# Altium project Smarthome_Wall_Switch.PrjPcb
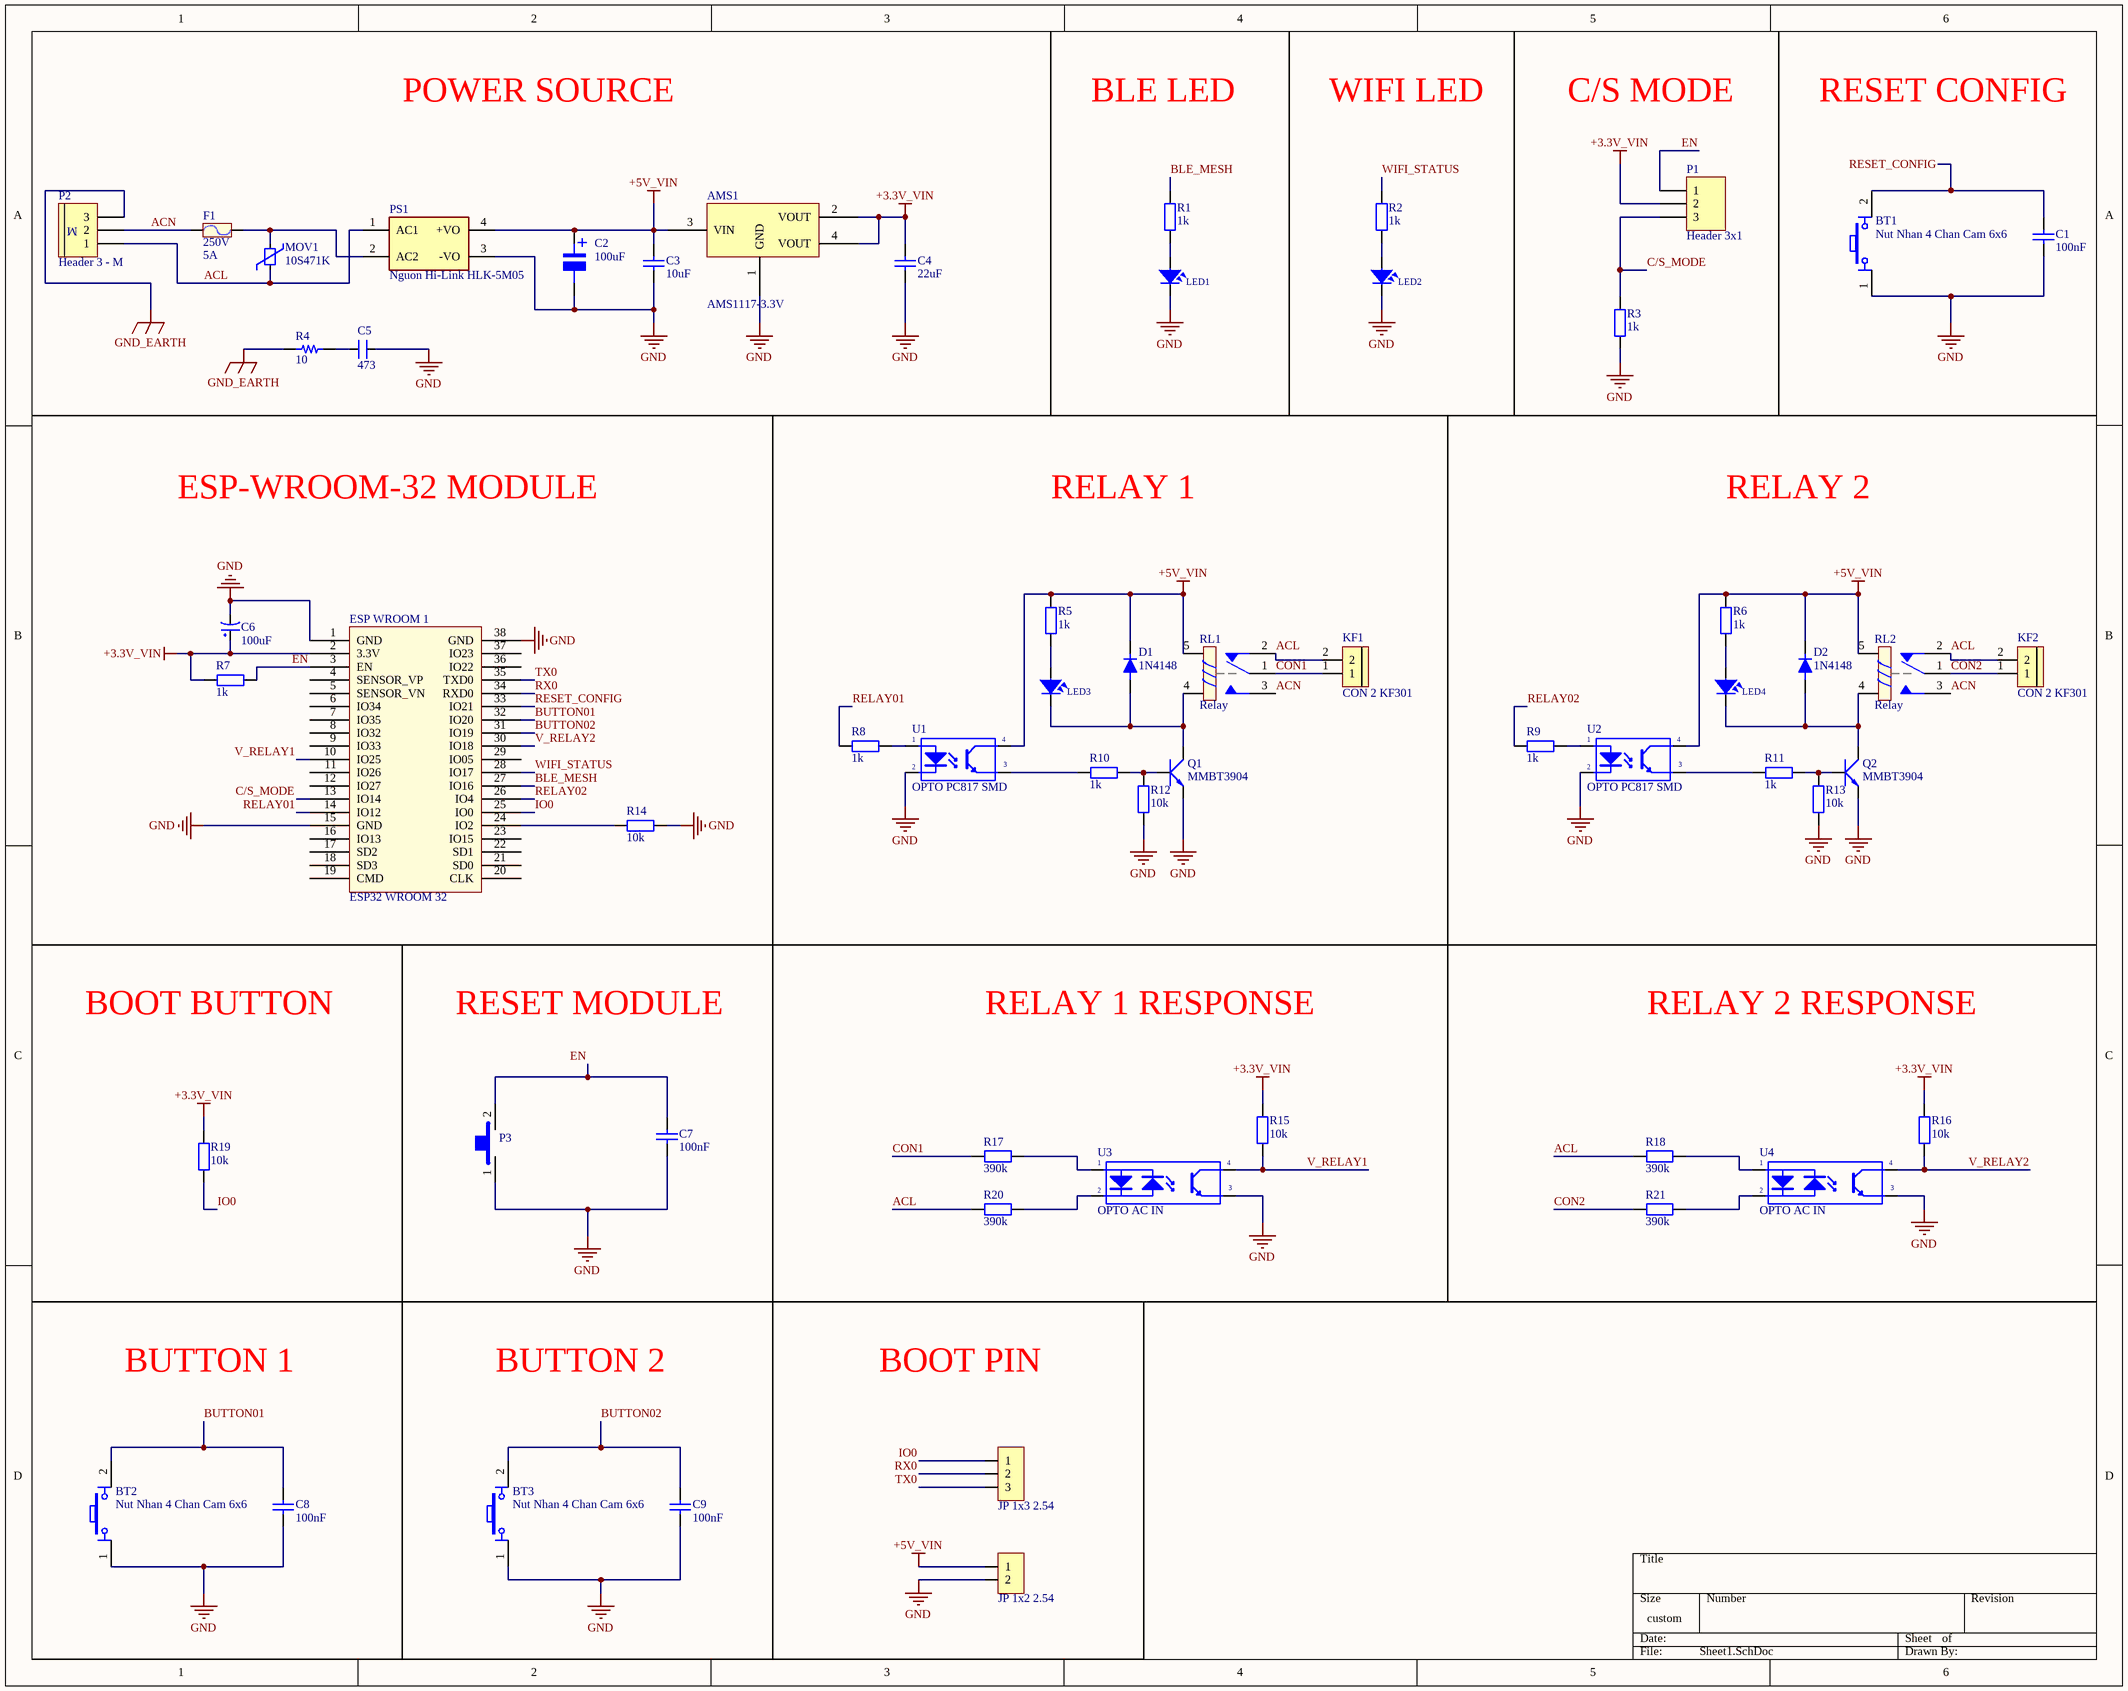
[diagram p0: Sheet1.SchDoc]
1 sheet, 59 parts. Net scope: global (net labels, ports and power ports of the same name join across sheets).
Board file: PCB1.PcbDoc

## Sheet Sheet1.SchDoc: Smarthome Wall Switch
size 406 x 322 mm; Author: Trinh Cao Cuong; DrawnBy: Trinh Cao Cuong; Organization: HUST; DocumentNumber: v1; SheetNumber: 1; SheetTotal: 1

### Parts
AMS1  AMS1117-3.3V  [SOT223]
BT1  Nut Nhan 4 Chan Cam 6x6  [Nut Nhan 4 Chan Cam 6x6]
BT2  Nut Nhan 4 Chan Cam 6x6  [Nut Nhan 4 Chan Cam 6x6]
BT3  Nut Nhan 4 Chan Cam 6x6  [Nut Nhan 4 Chan Cam 6x6]
C1  100nF  [C0603C/1608MM]
C2  100uF  [tu nhom 6.3 (d)]
C3  10uF  [C0603C/1608MM]
C4  22uF  [C0603C/1608MM]
C5  473  [CN3]
C6  100uF  [tu tantalum smd3528]
C7  100nF  [C0603C/1608MM]
C8  100nF  [C0603C/1608MM]
C9  100nF  [C0603C/1608MM]
D1  1N4148  [SOD-323]
D2  1N4148  [SOD-323]
ESP_WROOM_1  ESP32 WROOM 32  [ESP32-WROOM-32D]
F1  Voltage - Rated: 250V  Current Rating (Amps): 5A  [FUSE_VERTICAL]  (hidden comment: 5A220V)
JP1  JP 1x3 2.54  [JP 1x3 DT]
JP2  JP 1x2 2.54  [JP 1x2 DT]
KF1  CON 2 KF301  [Con 2 KF301 5.08]
KF2  CON 2 KF301  [Con 2 KF301 5.08]
LED1  LED SMD  [SM-LED-0805-Blue]  (value not drawn)
LED2  LED SMD  [SM-LED-0805-Blue]  (value not drawn)
LED3  LED SMD  [SM-LED-0805-Blue]  (value not drawn)
LED4  LED SMD  [SM-LED-0805-Blue]  (value not drawn)
MOV1  10S471K  [10S471K]
P1  Header 3x1  [HDR1X3]
P2  Header 3 - M  [Medium - Header 3]
P3  (no value)  [SW 2P SMD]
PS1  Nguon Hi-Link HLK-5M05  [Nguon HI-LINK 5M05]
Q1  MMBT3904  [SOT 23]
Q2  MMBT3904  [SOT 23]
R1  1k  [tro smd 0603]
R2  1k  [tro smd 0603]
R3  1k  [tro smd 0603]
R4  10  [R1206B/3216MM]
R5  1k  [tro smd 0603]
R6  1k  [tro smd 0603]
R7  1k  [tro smd 0603]
R8  1k  [tro smd 0603]
R9  1k  [tro smd 0603]
R10  1k  [tro smd 0603]
R11  1k  [tro smd 0603]
R12  10k  [tro smd 0603]
R13  10k  [tro smd 0603]
R14  10k  [tro smd 0603]
R15  10k  [tro smd 0603]
R16  10k  [tro smd 0603]
R17  390k  [tro smd 1206]
R18  390k  [tro smd 1206]
R19  10k  [tro smd 0603]
R20  390k  [tro smd 1206]
R21  390k  [tro smd 1206]
RL1  Relay  [Relay 5 Chan SRD]
RL2  Relay  [Relay 5 Chan SRD]
U1  OPTO PC817 SMD  [SOP4]
U2  OPTO PC817 SMD  [SOP4]
U3  OPTO AC IN  [LTV-354T]
U4  OPTO AC IN  [LTV-354T]

### Nets
+3.3V_VIN: AMS1.2(VOUT) AMS1.4(VOUT) C4.2 C6.1 ESP_WROOM_1.2(3.3V) P1.2 R7.2 R15.2 R16.2 R19.1
+5V_VIN: AMS1.3(VIN) C2.1 C3.2 D1.2(CATHODE) D2.2(CATHODE) JP2.1 PS1.4(+VO) R5.2 R6.2 RL1.5 RL2.5 U1.4(C) U2.4(C)
GND: AMS1.1(GND) BT1.1 BT2.1 BT3.1 C1.2 C2.2 C3.1 C4.1 C5.2 C6.2 C7.2 C8.2 C9.2 ESP_WROOM_1.1(GND) ESP_WROOM_1.15(GND) ESP_WROOM_1.38(GND) JP2.2 LED1.2 LED2.2 P3.1 PS1.3(-VO) Q1.2(E) Q2.2(E) R3.1 R12.1 R13.1 R14.1 U1.2(K) U2.2(K) U3.3(E) U4.3(E)
GND_EARTH: P2.3 R4.1
ACL: KF1.2 KF2.2 MOV1.2 P2.1 PS1.1(AC1) R18.1 R20.1 RL1.2 RL2.2
ACN: F1.2 P2.2 RL1.3 RL2.3
BLE_MESH: ESP_WROOM_1.27(IO16) R1.2
BUTTON01: BT2.2 C8.1 ESP_WROOM_1.32(IO20)
BUTTON02: BT3.2 C9.1 ESP_WROOM_1.31(IO19)
C/S_MODE: ESP_WROOM_1.13(IO14) P1.3 R3.2
CON1: KF1.1 R17.1 RL1.1
CON2: KF2.1 R21.1 RL2.1
EN: C7.1 ESP_WROOM_1.3(EN) P1.1 P3.2 R7.1
IO0: ESP_WROOM_1.25(IO0) JP1.1 R19.2
RELAY01: ESP_WROOM_1.14(IO12) R8.1
RELAY02: ESP_WROOM_1.26(IO4) R9.1
RESET_CONFIG: BT1.2 C1.1 ESP_WROOM_1.33(IO21)
RX0: ESP_WROOM_1.34(RXD0) JP1.2
TX0: ESP_WROOM_1.35(TXD0) JP1.3
V_RELAY1: ESP_WROOM_1.10(IO25) R15.1 U3.4(C)
V_RELAY2: ESP_WROOM_1.30(IO18) R16.1 U4.4(C)
WIFI_STATUS: ESP_WROOM_1.28(IO17) R2.2
NetC5_1: C5.1 R4.2
NetD1_1: D1.1(ANODE) LED3.2 Q1.3(C) RL1.4
NetD2_1: D2.1(ANODE) LED4.2 Q2.3(C) RL2.4
NetESP_WROOM_1_24: ESP_WROOM_1.24(IO2) R14.2
NetF1_1: F1.1 MOV1.1 PS1.2(AC2)
NetLED1_1: LED1.1 R1.1
NetLED2_1: LED2.1 R2.1
NetLED3_1: LED3.1 R5.1
NetLED4_1: LED4.1 R6.1
NetQ1_1: Q1.1(B) R10.2 R12.2
NetQ2_1: Q2.1(B) R11.2 R13.2
NetR8_2: R8.2 U1.1(A)
NetR9_2: R9.2 U2.1(A)
NetR10_1: R10.1 U1.3(E)
NetR11_1: R11.1 U2.3(E)
NetR17_2: R17.2 U3.1(A)
NetR18_2: R18.2 U4.1(A)
NetR20_2: R20.2 U3.2(K)
NetR21_2: R21.2 U4.2(K)

Not connected (* = marked no-connect by the designer): ESP_WROOM_1 4(SENSOR_VP) 5(SENSOR_VN) 6(IO34) 7(IO35) 8(IO32) 9(IO33) 11(IO26) 12(IO27) 16(IO13) 17(SD2) 18(SD3) 19(CMD) 20(CLK) 21(SD0) 22(SD1) 23(IO15) 29(IO05) 36(IO22) 37(IO23)

### Notes on the sheet
- POWER SOURCE
- BLE LED
- WIFI LED
- C/S MODE
- RESET CONFIG
- ESP-WROOM-32 MODULE
- RELAY 1
- RELAY 2
- BOOT BUTTON
- RESET MODULE
- RELAY 1 RESPONSE
- RELAY 2 RESPONSE
- BUTTON 1
- BUTTON 2
- BOOT PIN
- (in symbol Header 3 - M) M
- (in symbol Tu Nhom 100uF 16V) +

### Library data of the parts
AMS1 = AMS1117 SMD: Dán; Value: AMS1117-3.3V SOT223; Don_Vi: Con; Ma_Hang: MH000596; Ghi_Chu: *; Kieu_Chan: *; Chung_Loai: Dán
BT1-BT3 = Nut Nhan 4 Chan Cam 6x6: Nut Nhan 4 Chan 6x6mm; Ten: Nút Nhấn 4 Chân 6x6x5MM DIP; Ma_Hang: MH004584
C1 C7-C9 = CAP CER 100nF 16V 5% X7R 0603: Cap Ceramic 0.1uF 16V X7R 5% SMD 0603 125C T/R; Manufacturer: Yageo; Manufacturer Part Number: CC0603JRX7R7BB104; Supplier 1: Digi-Key; Stock 1: 333951; Pricing 1: 1=0.1, 10=0.077, 50=0.042, 100=0.0343, 500=0.02448, 1000=0.01923 (USD); Mount: Surface Mount; Case/Package: 0603; Number of Pins: 2; Case Code (Metric): 1608; Case Code (Imperial): 0603; Min Operating Temperature: -55°C; Max Operating Temperature: 125°C; Capacitance: 100nF; Tolerance: 5%; Voltage Rating: 16V; Packaging: Tape and Reel; Dielectric: X7R; Voltage Rating (DC): 16V; Series: CC; Length: 1.6mm; Width: 0.031inch; Thickness: 0.035inch; Depth: 0.8mm; Radiation Hardening: No; Lead Free: Lead Free; Halogen Free: Halogen Free; RoHS Compliant: Yes; ComponentLink1URL: https://www.verical.com/server-webapp/html/getDatasheet?partID=403543&src-supplier=Verical; ComponentLink1Description: https://www.verical.com/server-webapp/html/getDatasheet?partID=403543&src-supplier=Verical; Supplier Part Number 1: 311-1776-1-ND
C2 = Tu Nhom 100uF 16V: Dán; Don_Vi: Con; So_Chan: 2; Ten_Linh_Kien: Tụ Nhôm 100uF 16V 6.3x5.4MM; Ma_Hang: MH002219; Chung_Loai: Dán; Kieu_Chan: *
C3 C4 = CAP CER 10uF 16V X7R 0603: CAP CER 0603 10uF 16V X7R 10%
C5 = CN3: Cap np W0.3; Value: 0,047uF; Copyright: VanDungEvn
C6 = Tu tantalum 100uF 6.3V SMD3528: Dán; Don_Vi: Con; So_Chan: 2; Ten_Linh_Kien: Tụ tantalum 107J-100uF 6.3V SMD3528; Ma_Hang: MH007595; Chung_Loai: Dán; Kieu_Chan: *
D1 D2 = DIODE GEN PURP 75V 150MA DO35
F1 = Fuse: FUSE 220V 5A RADIAL; PROCESS_TYPE: MA; Unit: PCS; Response Time: 24S; Breaking Capacity @ Rated Voltage: 50A; DC Cold Resistance: 0.03 Ohms; Melting I²t: 0.919; CATEGORY: FUSE; Value: 5A220V; Package / Case: TH2
JP1 = JP 1x3 2.54 Duc Thang: Cắm; Ten_Linh_Kien: Jump Đơn Đực 2.54MM 1x40P Thẳng 11MM; Don_Vi: Con; Ma_Hang: MH000903; Ghi_Chu: *; Kieu_Chan: *; Chung_Loai: Cắm
JP2 = JP 1x2 2.54 Duc Thang: Cắm; Ten_Linh_Kien: Jump Đơn Đực 2.54MM 1x40P Thẳng 11MM; Don_Vi: Con; Ma_Hang: MH000903; Ghi_Chu: *; Kieu_Chan: *; Chung_Loai: Cắm
KF1 KF2 = CON 2 KF301: Cắm; Ma_Hang: MH000987; Ten_Linh_Kien: CON 2 KF301-2P 5.08MM Xanh Dương; Chung_Loai: Cắm; Ghi_Chu: *; Kieu_Chan: *; Don_Vi: Con
LED1-LED4 = LED SMD 0805
MOV1 = MOV 10S471K: VARISTOR 470V 2.5KA DISC 10MM; MANUFACTURER2_PART#: 10D391K 390V 10mm; MANUFACTURER1: Bourns; MANUFACTURER1_PART#: MOV-10D391K; LOH_CODE: CLA1220; Value: 10D391; MANUFACTURER2: http://linhkienchatluong.vn/tu-chong-set---varistor/tu-chong-set-varistor-10d391k-390v-10mm_sp1161_ct1335.aspx; CATEGORY: VARISTOR
P1 = Header 3x1: Header, 3-Pin, pitch 2.54mm; Solder: WAVE
P2 = Header 3 - M: Header, 3-Pin, Medium; LatestRevisionDate: 17-Jul-2002; LatestRevisionNote: Re-released for DXP Platform.; Publisher: Altium Limited
P3 = Button 2 SMD: SMD Mini Push Button Switch 2 Pin 3x6x2.7mm; MPN: SMD Mini Push Button 2 SMD; Link: https://ram-e-shop.com/product/press2pin-smd/
PS1 = Nguon Hi-Link HLK-5M05: AC DC 220V to 5V 5W 5Watt Isolated Switching Step-Down Power Supply Module Converter; Availability: Unavailable; SnapEDA_Link: https://www.snapeda.com/parts/HLK-5M05/Hi-link/view-part/2758659/?ref=snap; MF: Hi-link; Price: None; Package: Package Analog Devices; MP: HLK-5M05; Value: *
Q1 Q2 = TRANS NPN 40V 0.2A SOT23: Bipolar (BJT) Transistor NPN 40 V 200 mA 300MHz 350 mW Surface Mount SOT-23; Manufacturer: MCC; Manufacturer Part Number: 2SD882-GR-BP; Max Collector Current: 3A; Collector Emitter Breakdown Voltage: 30V; Collector-emitter Voltage-Max: 500mV; Max Power Dissipation: 1.25W; Transition Frequency: 50MHz; Supplier 1: Digi-Key; Stock 1: 0; Mount: Through Hole; Case/Package: TO-126-3; Min Operating Temperature: -55°C; Max Operating Temperature: 150°C; Series: -; Packaging: Bulk; ComponentLink1URL: https://media.digikey.com/pdf/Data%20Sheets/Micro%20Commercial%20PDFs/2SD882-x.pdf?src-supplier=Digi-Key; ComponentLink1Description: https://media.digikey.com/pdf/Data%20Sheets/Micro%20Commercial%20PDFs/2SD882-x.pdf?src-supplier=Digi-Key; Supplier Part Number 1: 2SD882-GR-BP-ND
R1-R3 R5-R11 = Tro 0603 1% 1k: Dán; So_Chan: 2; Don_Vi: Con; Ten_Linh_Kien: Trở 0603 1% 1k; Ma_Hang: MH006334; Chung_Loai: Dán; Kieu_Chan: *
R4 = RES SMD 3.3M OHM 5% 1/4W 1206: Surface Mount Thick Film Resistor, RC Series, 3.3Mohm, 100 mW, - 5%, 50 V, 1206; Manufacturer: Yageo; Manufacturer Part Number: RC1206JR-073M3L; Resistance: 3.3MR; Power Rating: 250mW; Voltage Rating: 200V; Temperature Coefficient: 100ppm/°C; Supplier 1: Digi-Key; Stock 1: 9900; Pricing 1: 1=0.1, 10=0.063, 100=0.0258, 1000=0.01158, 2500=0.01005 (USD); Case Code (Metric): 3216; Case Code (Imperial): 1206; Min Operating Temperature: -55°C; Max Operating Temperature: 155°C; Tolerance: 5%; Packaging: Tape and Reel; Package Quantity: 5000; Resistor Type: Thick Film; Number of Terminations: 2; Termination: SMD/SMT; Max Power Dissipation: 250mW; Voltage Rating (DC): 200V; Features: Moisture Resistant; Series: RC; Construction: Rectangular; Length: 0.122inch; Width: 0.063inch; Height: 0.026inch; Depth: 1.6mm; Military Standard: Not; Lead Free: Lead Free; RoHS Compliant: Yes; ComponentLink1URL: http://www.yageo.com.tw/exep/pages/download/literatures/PYu-R_INT-thick_7.pdf?src-supplier=Digi-Key; ComponentLink1Description: http://www.yageo.com.tw/exep/pages/download/literatures/PYu-R_INT-thick_7.pdf?src-supplier=Digi-Key; Supplier Part Number 1: 311-3.3MERCT-ND; Case/Package: 1206
R12-R16 R19 = Tro 0603 1% 10k: Dán; Don_Vi: Con; So_Chan: 2; Ten_Linh_Kien: Trở 0603 1% 10k; Ma_Hang: MH006333; Chung_Loai: Dán; Kieu_Chan: *
R17 R18 R20 R21 = Tro 1206 1% 390k: Dán; Don_Vi: Con; So_Chan: 2; Ten_Linh_Kien: Trở 1206 1% 390k; Ma_Hang: MH005898; Chung_Loai: Dán; Kieu_Chan: *
RL1 RL2 = Relay 5 Chan SRD: Relay 5 Chan; Ma_Hang: MH009374; Ten: Relay 5V10A SRD-05VDC-SL-C Chính Hãng
U1 U2 = OPTO PC817 SMD: Single Opto; Value: PC817
U3 U4 = LTV-354T: AC INPUT Opto